# EAGLE design ControlModule (EAGLE 9.6.2)
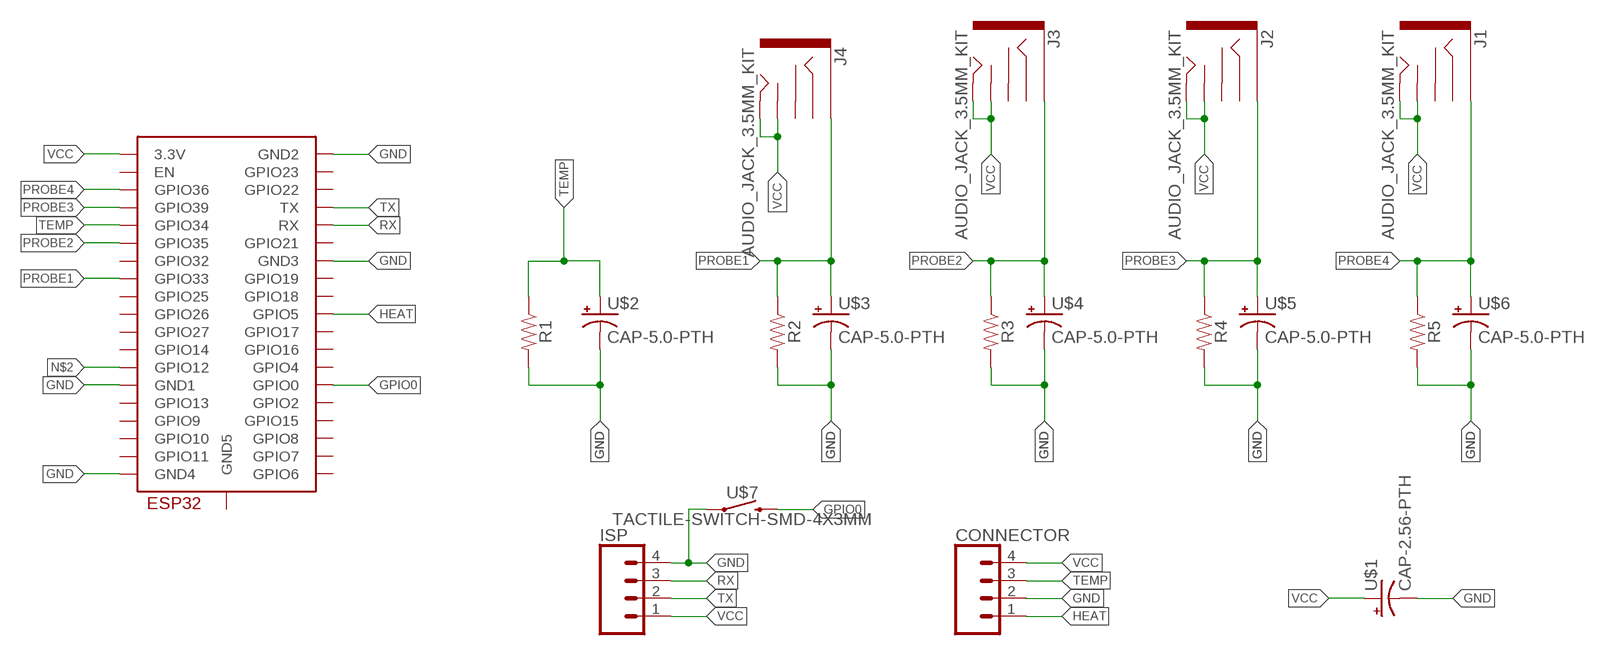
[diagram p0: schematic, sheet 1]

## Parts
CONNECTOR  CONN_04PTH  [1X04]
ISP  CONN_04PTH  [1X04]
J1  AUDIO_JACK_3.5MM_KIT  [AUDIO-JACK-KIT]
J2  AUDIO_JACK_3.5MM_KIT  [AUDIO-JACK-KIT]
J3  AUDIO_JACK_3.5MM_KIT  [AUDIO-JACK-KIT]
J4  AUDIO_JACK_3.5MM_KIT  [AUDIO-JACK-KIT]
R1  RESISTOR0805  [0805]
R2  RESISTOR0805  [0805]
R3  RESISTOR0805  [0805]
R4  RESISTOR0805  [0805]
R5  RESISTOR0805  [0805]
U$1  CAP-2.56-PTH  [CAP-PTH-2.5MM-5MM]
U$2  CAP-5.0-PTH  [CAP-PTH-5MM]
U$3  CAP-5.0-PTH  [CAP-PTH-5MM]
U$4  CAP-5.0-PTH  [CAP-PTH-5MM]
U$5  CAP-5.0-PTH  [CAP-PTH-5MM]
U$6  CAP-5.0-PTH  [CAP-PTH-5MM]
U$7  TACTILE-SWITCH-SMD-4X3MM  [TACTILE_SWITCH_SMD_4X3MM]
U$8  ESP32-WROOM  [ESP32-WROOM]

## Nets
GND: CONNECTOR.2 ISP.4 R1.2 R2.2 R3.2 R4.2 R5.2 U$1.2(-) U$2.2(-) U$3.2(-) U$4.2(-) U$5.2(-) U$6.2(-) U$7.1 U$8.GND1 U$8.GND2 U$8.GND3 U$8.GND4
GPIO0: U$7.2 U$8.IO0(GPIO0)
HEAT: CONNECTOR.1 U$8.IO5(GPIO5)
N$2: U$8.IO12(GPIO12)
PROBE1: J4.SLEEVE R2.1 U$3.1(+) U$8.IO33(GPIO33)
PROBE2: J3.SLEEVE R3.1 U$4.1(+) U$8.IO35(GPIO35)
PROBE3: J2.SLEEVE R4.1 U$5.1(+) U$8.SENSOR_VN(GPIO39)
PROBE4: J1.SLEEVE R5.1 U$6.1(+) U$8.SENSOR_VP(GPIO36)
RX: ISP.3 U$8.RX
TEMP: CONNECTOR.3 R1.1 U$2.1(+) U$8.IO34(GPIO34)
TX: ISP.2 U$8.TX
VCC: CONNECTOR.4 ISP.1 J1.TIP J1.TSH J2.TIP J2.TSH J3.TIP J3.TSH J4.TIP J4.TSH U$1.1(+) U$8.3V3(3.3V)
Unconnected: J1.RING J1.RSH J2.RING J2.RSH J3.RING J3.RSH J4.RING J4.RSH U$8.CLK(GPIO6) U$8.CMD(GPIO11) U$8.EN U$8.GND5 U$8.IO2(GPIO2) U$8.IO4(GPIO4) U$8.IO13(GPIO13) U$8.IO14(GPIO14) U$8.IO15(GPIO15) U$8.IO16(GPIO16) U$8.IO17(GPIO17) U$8.IO18(GPIO18) U$8.IO19(GPIO19) U$8.IO21(GPIO21) U$8.IO22(GPIO22) U$8.IO23(GPIO23) U$8.IO25(GPIO25) U$8.IO26(GPIO26) U$8.IO27(GPIO27) U$8.IO32(GPIO32) U$8.SD0(GPIO7) U$8.SD1(GPIO8) U$8.SD2(GPIO9) U$8.SD3(GPIO10)

## Library data of the parts
CONNECTOR ISP = SparkFun-Connectors:CONN_04: Multi connection point. Often used as Generic Header-pin footprint for 0.1 inch spaced/style header connections On any of the 0.1 inch spaced packages, you can populate with these: Break Away Headers - Straight <https://www.sparkfun.com/products/116> (PRT-00116) Break Away Male Headers - Right Angle <https://www.sparkfun.com/products/553> (PRT-00553) Female Headers <https://www.sparkfun.com/products/115> (PRT-00115) Break Away Headers - Machine Pin <https://www.sparkfun.com/products/117> (PRT-00117) Break Away Female Headers - Swiss Machine Pin <https://www.sparkfun.com/products/743> (PRT-00743) For SCREWTERMINALS and SPRING TERMINALS visit here: Screw Terimnals on SparkFun.com <https://www.sparkfun.com/search/results?term=Screw+Terminals> (5mm/3.5mm/2.54mm spacing) This device is also useful as a general connection point to wire up your design to another part of your project. Our various solder wires solder well into these plated through hole pads. Hook-Up Wire - Assortment (Stranded, 22 AWG) <https://www.sparkfun.com/products/11375> (PRT-11375) Hook-Up Wire - Assortment (Solid Core, 22 AWG) <https://www.sparkfun.com/products/11367> (PRT-11367) View the entire wire category on our website here <https://www.sparkfun.com/categories/141> Special notes: Molex polarized connector foot print use with SKU : PRT-08231 with associated crimp pins and housings. 1MM SMD Version SKU: PRT-10208; PROD_ID: CONN-09696
J1-J4 = SparkFun-Connectors:AUDIO_JACK_3.5MM: Audio Jack 3.5mm variants of PTH and SMT stereo audio jack with bypass switches. SparkFun Products: SparkFun SparkPunk Sound Kit <[https://www.sparkfun.com/products/11177]> - PTH MP3 Trigger <https://www.sparkfun.com/products/13720> -3.5mm SMD SparkFun PicoBoard <https://www.sparkfun.com/products/11888>- 2.5mm SMD; PROD_ID: CONN-08774; SF_ID: PRT-08032
R1-R5 = SparkFun-Resistors:RESISTOR: Generic Resistor Package
U$1 = Custom:CAP-2.56-PTH
U$2-U$6 = Custom:CAP-5.0-PTH
U$7 = Custom:TACTILE-SWITCH-SMD-4X3MM
U$8 = ESP32:ESP32-WROOM

## Board
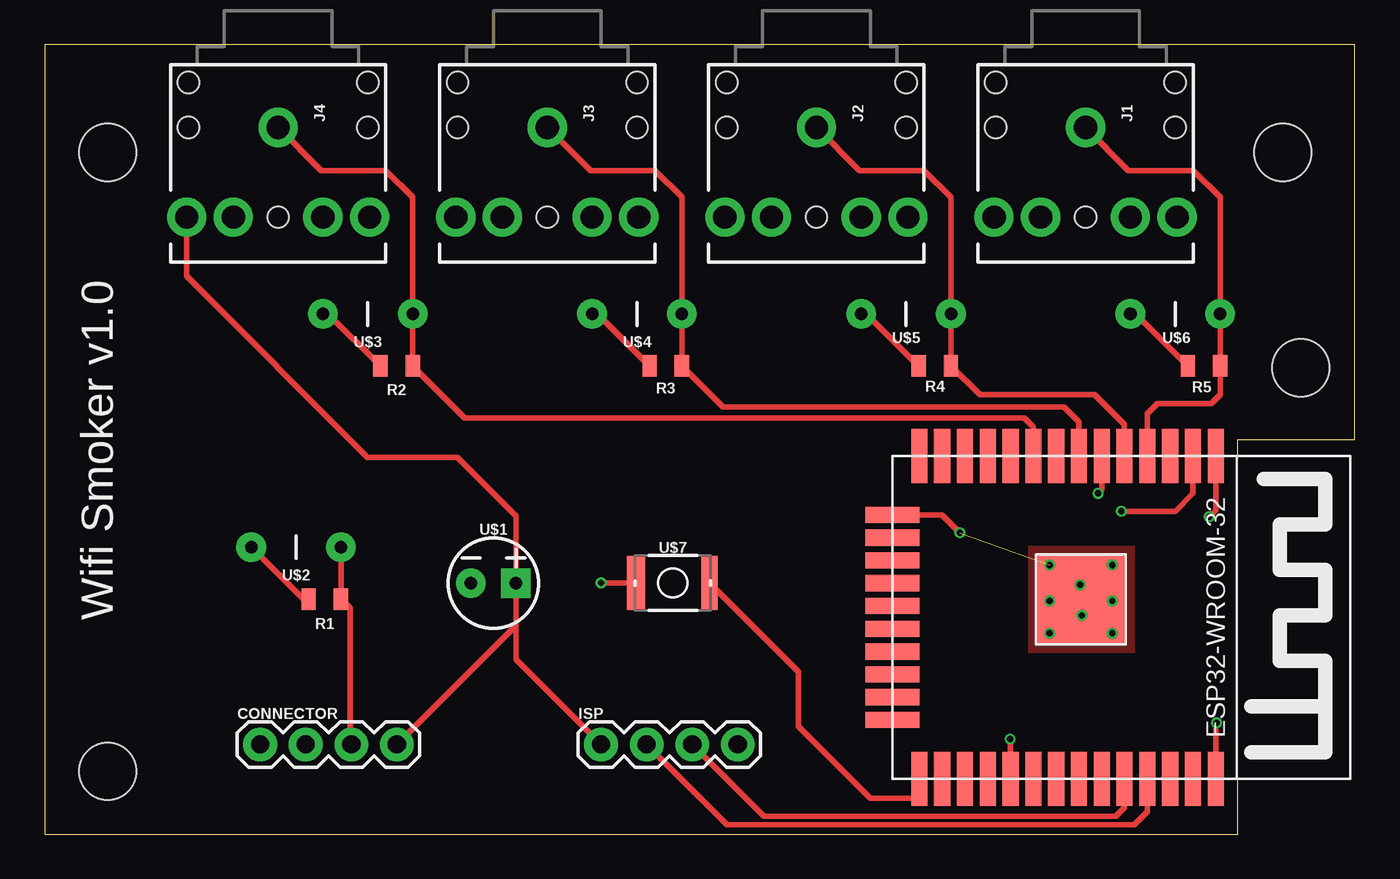
[diagram p1: board, top side]
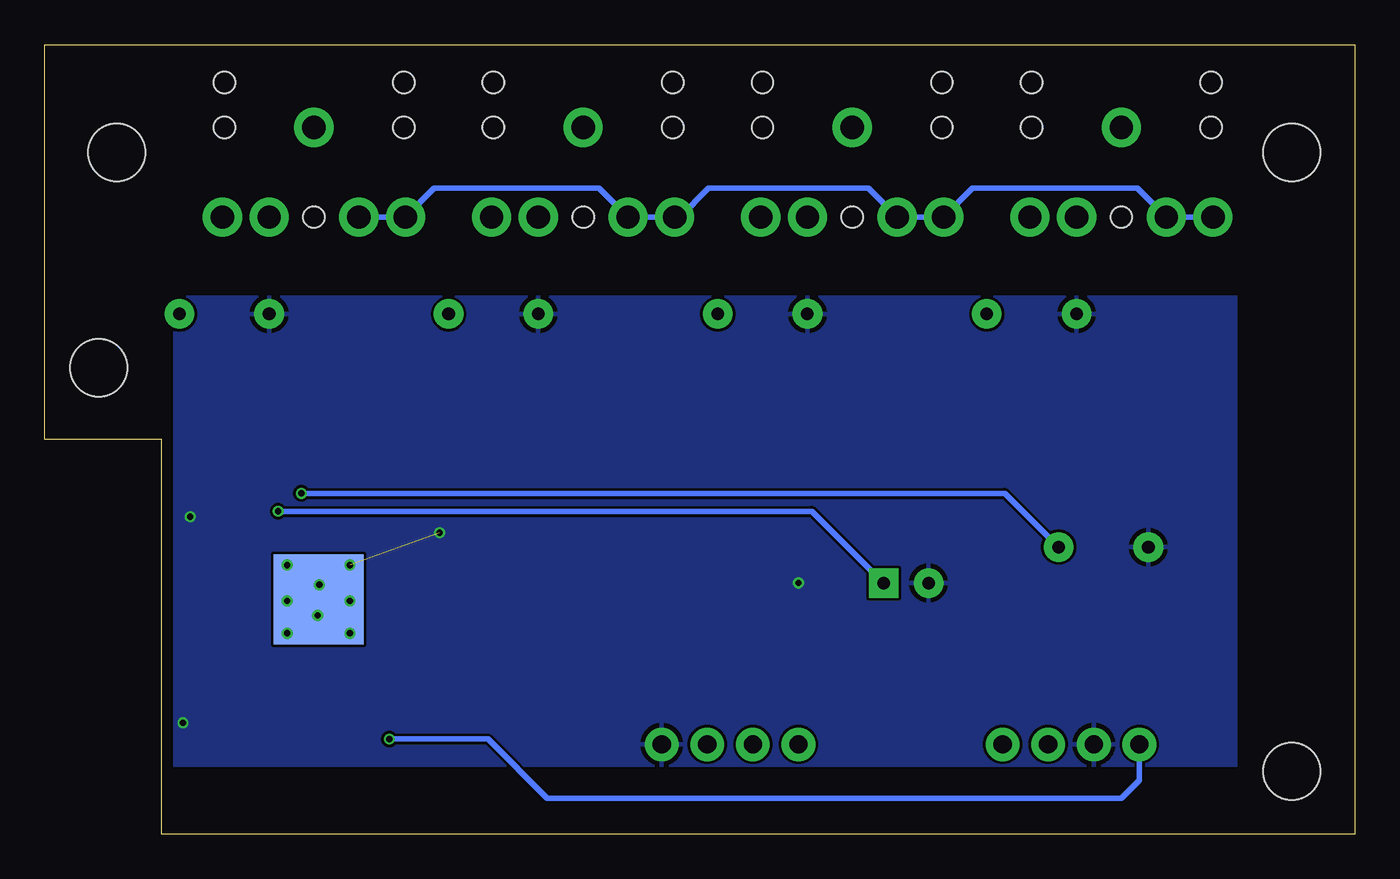
[diagram p2: board, bottom side, seen from below]

Size 73 x 44 mm. Coordinates in mm from the lower left corner, seen from the top.
Outline: 0,0 66.5,0 66.5,22 73,22 73,44 0,44 0,0
Copper layers (1*16): Top 0.035559375mm / dielectric 1.6mm / Bottom 0.035559375mm
Design rules "oshpark-2layer": minimum track width 6mil, minimum drill 10mil, track to track 6mil, track to pad 6mil, pad to pad 6mil, via to via 6mil, smd to smd 6mil, copper to edge 15mil, drill to drill 6mil, minimum pad ring 5mil, minimum via ring 5mil, stop-mask expansion 2.5mil, vias tented up to drill 0mil, thermal gap 10mil
Holes 3.2 mm at 69,38 70,26 3.5,3.5 3.5,38

### Footprints (pad centres in the part's own frame; a part is rotated, then mirrored left to right if it is on the bottom)
1X04 = drill 1.016 pad 1.88: 1 0,0; 2 2.54,0; 3 5.08,0; 4 7.62,0
AUDIO-JACK-KIT = drill 1.3 pad 2.184: RING 5,5.1; RSH 5,2.5; SLEEVE 0,0; TIP 5,-5.1; TSH 5,-2.5 | hole 1.2: 0,5; -2.5,5; -2.5,-5; 0,-5; 5,0
0805 = smd 0.8 x 1.2: 1 -0.9,0; 2 0.9,0
CAP-PTH-2.5MM-5MM = drill 0.7 pad 1.651 square: 1 1.25,0 | drill 0.7 pad 1.651: 2 -1.25,0
CAP-PTH-5MM = drill 0.7 pad 1.651: 1 -2.5,0; 2 2.5,0
TACTILE_SWITCH_SMD_4X3MM = smd 1 x 2.997: 1 -2.05,0 | smd 0.9 x 2.997: 2 2.05,0
ESP32-WROOM = smd 3 x 0.9: 3V3 0,16.74; EN 0,15.47; GND1 0,18.01; GND3 18,18.01; IO0 18,1.5; IO4 18,2.77; IO5 18,6.58; IO12 0,1.5; IO14 0,2.77; IO16 18,4.04; IO17 18,5.31; IO18 18,7.85; IO19 18,9.12; IO21 18,11.66; IO22 18,15.47; IO23 18,16.74; IO25 0,6.58; IO26 0,5.31; IO27 0,4.04; IO32 0,9.12; IO33 0,7.85; IO34 0,11.66; IO35 0,10.39; NC 18,10.39; RX 18,12.93; SENSOR_VN 0,12.93; SENSOR_VP 0,14.2; TX 18,14.2 | smd 0.9 x 3: CLK 9.635,0; CMD 8.365,0; GND2 3.285,0; IO2 14.715,0; IO13 4.555,0; IO15 13.445,0; SD0 10.905,0; SD1 12.175,0; SD2 5.825,0; SD3 7.095,0 | smd 5 x 5: GND4 8,10.5 | smd 5 x 5 bottom: GND5 8,10.5

### Placement (x,y rotation side)
CONNECTOR  12,5 0 top
ISP  31,5 0 top
J1  58,39.4 270 top
J2  43,39.4 270 top
J3  28,39.4 270 top
J4  13,39.4 270 top
R1  15.6,13.1 180 top
R2  19.6,26.1 180 top
R3  34.6,26.1 180 top
R4  49.6,26.1 180 top
R5  64.6,26.1 180 top
U$1  25,14 0 top
U$2  14,16 180 top
U$3  18,29 180 top
U$4  33,29 180 top
U$5  48,29 180 top
U$6  63,29 180 top
U$7  35,14 0 top
U$8  47.24,21.08 270 top

### Tracks (layer width: path | path; a pad name or v marks a point on that pad's centre or on a via)
GND  (via drill 0.35)  (1 unrouted)
  Top 0.305: R4.2 45.8,29 U$5.2 | R5.2 60.8,29 U$6.2 | R3.2 30.8,29 U$4.2 | R2.2 15.8,29 U$3.2 | U$2.2 14.4,13.1 R1.2 | U$7.1 v31,14 | U$8.GND2 50,17.8 v51,16.8 | U$8.GND3 65.25,6.2 v65.3,6.2 | U$8.GND1 65.25,18.05 v64.9,17.7
  other vias: 56,15 56,13 56,11.2 59.5,15 59.5,13 59.5,11.2 57.7,13.9 57.8,12.2
  pour Bottom: 6.6,29.97 6.6,3.81 65.79,3.81 65.79,29.97
  pour Top (no thermals): 54.86,16 54.86,10.16 60.71,10.16 60.71,16
GPIO0
  Top 0.305: U$7.2 42,9.05 42,6 46,2 49,2 49,2.83 U$8.IO0
HEAT  (via drill 0.35)
  Top 0.305: U$8.IO5 53.82,5.28 v53.8,5.3
  Bottom 0.305: CONNECTOR.1 12,3 13,2 45,2 48.3,5.3 v53.8,5.3
PROBE1
  Top 0.305: J4.SLEEVE 15.4,37 19,37 20.5,35.5 U$3.1 R2.1 23.4,23.2 54.6,23.2 55.09,22.71 U$8.IO33
PROBE2
  Top 0.305: J3.SLEEVE 30.4,37 34,37 35.5,35.5 U$4.1 R3.1 37.8,23.8 56.8,23.8 57.63,22.97 U$8.IO35
PROBE3
  Top 0.305: J2.SLEEVE 45.4,37 49,37 50.5,35.5 U$5.1 R4.1 52.1,24.5 58.5,24.5 60.17,22.83 U$8.SENSOR_VN
PROBE4
  Top 0.305: J1.SLEEVE 60.4,37 64,37 65.5,35.5 U$6.1 R5.1 65.5,24.5 65,24 62,24 61.44,23.44 U$8.SENSOR_VP
RX
  Top 0.305: ISP.3 40.08,1 59.7,1 60.17,1.47 U$8.RX
TEMP  (via drill 0.35)
  Top 0.305: CONNECTOR.3 17,5.08 17,12.6 R1.1 U$2.1 | U$8.IO34 58.9,19.2 v58.7,19
  Bottom 0.305: U$2.1 19.5,19 v58.7,19
TX
  Top 0.305: ISP.2 38.01,0.53 60.73,0.53 61.44,1.24 U$8.TX
VCC  (via drill 0.35)
  Top 0.305: CONNECTOR.4 26.25,11.63 U$1.1 | ISP.1 26.25,9.75 U$1.1 | J4.TIP 7.9,31.1 18,21 23,21 26.25,17.75 U$1.1 | U$8.3V3 63.98,19.02 63.98,18.98 63,18 v60,18
  Bottom 0.305: J1.TSH J1.TIP 51.3,36 42.1,36 J2.TSH J2.TIP 37.6,34.4 36,36 27.1,36 J3.TSH J3.TIP 21.3,36 12.1,36 J4.TSH J4.TIP | U$1.1 30.25,18 v60,18

### Text on the board
tPlace: Wifi Smoker v1.0